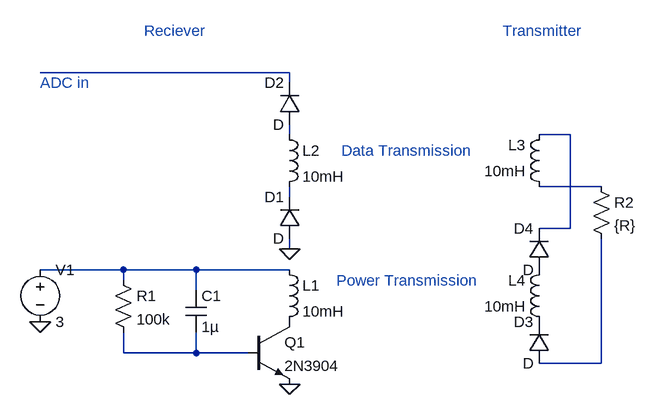
[diagram p0: schematic FoodTag_5_component.asc]
FoodTag_5_component.asc, the LTspice schematic file:
Version 4
SHEET 1 880 680
WIRE 208 -256 -176 -256
WIRE 208 -240 208 -256
WIRE 208 -160 208 -176
WIRE 640 -160 592 -160
WIRE 688 -80 592 -80
WIRE 208 -64 208 -80
WIRE 640 -16 640 -160
WIRE 640 -16 592 -16
WIRE 208 16 208 0
WIRE -48 48 -176 48
WIRE 64 48 -48 48
WIRE 208 48 64 48
WIRE -48 64 -48 48
WIRE 64 80 64 48
WIRE -48 176 -48 144
WIRE 64 176 64 144
WIRE 64 176 -48 176
WIRE 144 176 64 176
WIRE 688 192 688 0
WIRE 688 192 592 192
FLAG -176 128 0
FLAG 208 16 0
FLAG 208 224 0
SYMBOL npn 144 128 R0
SYMATTR InstName Q1
SYMATTR Value 2N3904
SYMBOL cap 48 80 R0
SYMATTR InstName C1
SYMATTR Value 1µ
SYMBOL res -64 48 R0
SYMATTR InstName R1
SYMATTR Value 100k
SYMBOL voltage -176 32 R0
WINDOW 123 0 0 Left 0
WINDOW 39 0 0 Left 0
SYMATTR InstName V1
SYMATTR Value 3
SYMBOL ind 192 32 R0
SYMATTR InstName L1
SYMATTR Value 10mH
SYMBOL ind 192 -176 R0
SYMATTR InstName L2
SYMATTR Value 10mH
SYMBOL diode 224 0 R180
WINDOW 0 24 64 Left 2
WINDOW 3 24 0 Left 2
SYMATTR InstName D1
SYMBOL diode 224 -176 R180
WINDOW 0 24 64 Left 2
WINDOW 3 24 0 Left 2
SYMATTR InstName D2
SYMBOL ind 608 -64 R180
WINDOW 0 36 80 Left 2
WINDOW 3 36 40 Left 2
SYMATTR InstName L3
SYMATTR Value 10mH
SYMBOL ind 608 144 R180
WINDOW 0 36 80 Left 2
WINDOW 3 36 40 Left 2
SYMATTR InstName L4
SYMATTR Value 10mH
SYMBOL diode 608 192 R180
WINDOW 0 24 64 Left 2
WINDOW 3 24 0 Left 2
SYMATTR InstName D3
SYMBOL diode 608 48 R180
WINDOW 0 24 64 Left 2
WINDOW 3 24 0 Left 2
SYMATTR InstName D4
SYMBOL res 672 -96 R0
SYMATTR InstName R2
SYMATTR Value {R}
TEXT -176 -240 Left 2 ;ADC in
TEXT -16 -320 Left 2 ;Reciever
TEXT 536 -320 Left 2 ;Transmitter
TEXT 280 64 Left 2 ;Power Transmission
TEXT 288 -136 Left 2 ;Data Transmission

The netlist it stands for:
* FoodTag_5_component.asc
Q1 P001 N007 0 0 2N3904
C1 N006 N007 1µ
R1 N006 N007 100k
V1 N006 0 3
L1 N006 P001 10mH
L2 N002 N005 10mH
D1 0 N005 D
D2 N002 N001 D
L3 N004 N003 10mH
L4 P002 P003 10mH
D3 N008 P002 D
D4 P003 N003 D
R2 N004 N008 {R}
.model D D
.lib standard.dio
.model NPN NPN
.model PNP PNP
.lib standard.bjt
* ADC in
* Reciever
* Transmitter
* Power Transmission
* Data Transmission
.backanno
.end